# Altium schematic sheet H_bridge_v2.SchDoc
size A4
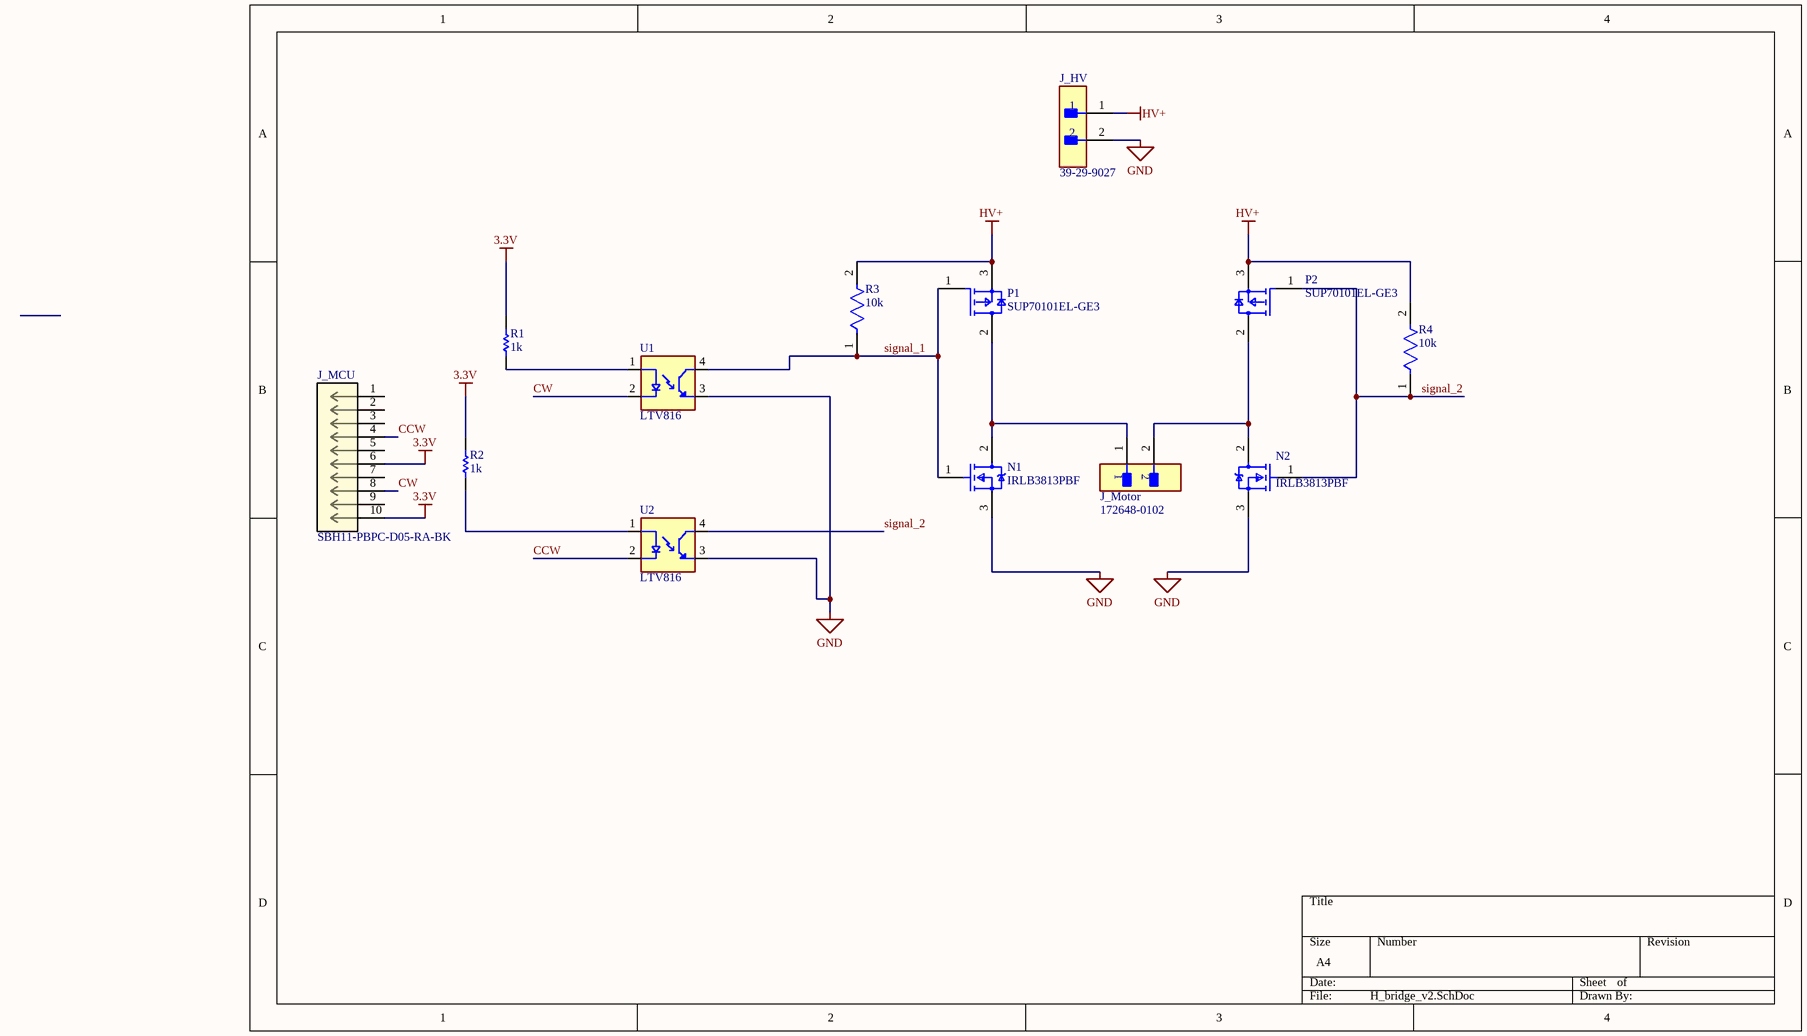
[diagram p0: H_bridge_v2.SchDoc]

## Parts
J_HV  39-29-9027  [FP-39-29-9027-MFG]
J_MCU  SBH11-PBPC-D05-RA-BK  [CONN10_D05-RA-BK_SUL]
J_Motor  172648-0102  [FP-172648-0102-MFG]
N1  IRLB3813PBF  [FP-PG-TO220-3-MFG]
N2  IRLB3813PBF  [FP-PG-TO220-3-MFG]
P1  SUP70101EL-GE3  [FP-SUP70101EL-GE3-MFG]
P2  SUP70101EL-GE3  [FP-SUP70101EL-GE3-MFG]
R1  1k  [RESA60-630X240]
R2  1k  [RESA60-630X240]
R3  10k  [FP-MF0207-MFG]
R4  10k  [FP-MF0207-MFG]
U1  LTV816  [DIP762W50P254L460H450Q4]
U2  LTV816  [DIP762W50P254L460H450Q4]

## Nets
3.3V: J_MCU.6 J_MCU.10 R1.2 R2.2
GND: J_HV.2 N1.3(S) N2.3(S) U1.3(ET) U2.3(ET)
HV+: J_HV.1 P1.3(S) P2.3(S) R3.2 R4.2
CCW: J_MCU.4 U2.2(C)
CW: J_MCU.8 U1.2(C)
signal_1: N1.1(G) P1.1(G) R3.1 U1.4(CT)
signal_2: N2.1(G) P2.1(G) R4.1 U2.4(CT)
NetJ_Motor_1: J_Motor.1 N1.2(D) P1.2(D)
NetJ_Motor_2: J_Motor.2 N2.2(D) P2.2(D)
NetR1_1: R1.1 U1.1(A)
NetR2_1: R2.1 U2.1(A)

Not connected (* = marked no-connect by the designer): J_MCU 1 2 3 5 7 9

## Library data of the parts
J_HV = CMP-04776-000798-1: CONN HEADER VERT 2POS; Insulation Resistance: 1GR; Max Voltage Rating (DC): 600.6kV; Gender: Female; Glow Wire Compliant: Non-compliant; Current Rating: 9A; Contact Resistance: 10mR; Number of Circuits: 2; Row Spacing: 0.165inch; Max Voltage Rating (AC): 600V; Pitch: 4.2mm; Max Current Rating: 5A; Length: 22.15mm; Housing Color: Natural; Orientation: Straight; Contact Material: Brass; Termination: Solder; Height: 9.91mm; Min Operating Temperature: -40°C; Contact Plating: Tin; Flammability Rating: UL94 V-0; Contact Gender: Male; Color: Natural; Contact Type: Male Pin; Depth: 8.77mm; Packaging: Tray; Series: Mini-Fit® Jr™ 5566; Number of Positions: 2; RoHS Compliant: Yes; Number of Contacts: 2; Radiation Hardening: No; Fastening Type: Ramp; Voltage Rating (DC): 600V; Halogen Free: Low Halogen; Mount: Through Hole; Number of Rows: 2; Max Operating Temperature: 105°C; Voltage Rating: 600V; Housing Material: Nylon
J_MCU = SBH11-PBPC-D05-RA-BK: Description; Manufacturer_Name: Sullins; Copyright: Copyright (C) 2026 Ultra Librarian. All rights reserved.; Manufacturer_Part_Number: SBH11-PBPC-D05-RA-BK; RefDes: RefDes; Type: Type
J_Motor = CMP-04776-000216-1: CONN HEADER R/A 2POS 4.2MM
N1 N2 = CMP-32901-000118-1: MOSFET N-CH 30V 260A TO-220AB; Manufacturer: Infineon; Threshold Vgs Max: 2.35V; Gate To Source Voltage: 20V; Number Of N Channels: 1; Threshold Vgs Min: 1.35V; Gate Charge At Vgs: 57nC @ 4.5V; Depletion Mode: False; Max Junction Temp: +175°C; Standoff Height: 3.37mm; Input Capacitace At Vds: 8420pF @ 15V; Reverse Recovery Charge: 22nC; Drain To Source Resistance: 2mΩ; Reverse Recovery Time: 24ns; Pulse Drain Current: 1050A; Turn Off Delay Time: 33ns; Turn On Delay Time: 36ns; Rthja Max: 62°C/W; Max Forward Diode Voltage: 1V; Power Dissipation: 230W; Digikey Description: MOSFET N-CH 30V 260A TO-220AB; Device Class L2: Transistors; Device Class L3: MOSFETs; Device Class L1: Discrete Semiconductors; Footprint Url: https://www.infineon.com/dgdl/po-to220ab-fp.pdf?fileId=5546d462580663ef0158068cfbee01be; ComponentLink2Description: Datasheet; Continuous Drain Current: 260A; Drain To Source Voltage: 30V; Temperature: -55°C to +175°C; Temperature Range Low: -55°C; Octopart: https://octopart.com/irlb3813pbf-infineon-65874923; Number Of Channels: 1; Drain To Source Breakdown Voltage: 30V; Height: 19.8mm; Temperature Range High: +175°C; RoHS: TRUE; Automotive: No; Category: Trans; ComponentLink2URL: https://www.infineon.com/dgdl/irlb3813pbf.pdf?fileId=5546d462533600a4015356603cfe258b; Manufacturer Part Number: IRLB3813PBF; Package: PG-TO220-3; Lead Free: Yes
P1 P2 = CMP-02550-000106-1: MOSFET P-CH 100V 120A TO220AB; Manufacturer: Vishay; Power Dissipation: 375W; Turn On Delay Time: 20ns; Drain To Source Breakdown Voltage: -100V; Gate To Source Voltage: 20V; Max Forward Diode Voltage: -1.5V; Depletion Mode: False; Rthja Max: 40°C/W; Threshold Vgs Max: -2.5V; Drain To Source Resistance: 0.0081Ω; Reverse Recovery Time: 110ns; Transconductance: 60S; Max Junction Temp: +175°C; Number Of Channels: 1; Pulse Drain Current: -240A; Gate Charge At Vgs: 125nC @ -10V; Input Capacitace At Vds: 7000pF @ -50V; Reverse Recovery Charge: 380nC; Continuous Drain Current: -120A; Typ Forward Diode Voltage: -1V; Standoff Height: 3.32mm; Digikey Description: MOSFET P-CH 100V 120A TO220AB; ComponentLink2Description: Datasheet; Category: Trans; Lead Free: Yes; Automotive: No; ComponentLink2URL: http://www.vishay.com/docs/77632/sup70101el.pdf; Device Class L1: Discrete Semiconductors; RoHS: TRUE; Height: 19.31mm; Octopart: https://octopart.com/sup70101el-ge3-vishay-82190902; Threshold Vgs Min: -1.5V; Drain To Source Voltage: -100V; Ipc Land Pattern Name: TO-220; Turn Off Delay Time: 110ns; Device Class L2: Transistors; Temperature: -55°C to +175°C; Package: TO-220AB; Temperature Range High: +175°C; Number Of P Channels: 1; Manufacturer Part Number: SUP70101EL-GE3; Footprint Url: https://www.vishay.com/docs/71195/to220ab.pdf; Device Class L3: MOSFETs; Temperature Range Low: -55°C
R1 R2 = CMP-1659-00075-1: Axial Resistor, 1 KOhm, +/- 1%, 250 mW, -55 to 155 degC, 2-Pin THD, RoHS, Bulk; Voltage Rating: 250 V; Resistance: 10 kohm; Power Rating: 250 mW; ComponentLink2Description: Datasheet; RoHSCompliant: true; PackageReference: MFR-25; Case\Package: Axial; Max Operating Temperature: 155 degC; DatasheetVersion: Apr-13; Tolerance: 1%; ComponentLink1URL: http://www.yageo.com/; Length: 0.248 inch; ComponentLink2URL: http://www.yageo.com/documents/recent/Yageo%20LR_MFR_2013.pdf; Packaging: Bulk; Package Quantity: 200; PackageDescription: 2-Pin Axial Lead, Dia 2.4 mm, Body Length 6.3 mm; Min Operating Temperature: -55 degC; ComponentLink1Description: Manufacturer URL
R3 R4 = CMP-03413-000006-1: RES 10K OHM 1% 0.6W AXIAL; Temperature Coefficient: 50ppm/°C; Resistance: 10kR; Mount: Through Hole; Radiation Hardening: No; Tolerance: 1%; Construction: Cylindrical; Contact Plating: Tin; Case/Package: Conformal; Resistor Type: Metal Film; Min Operating Temperature: -55°C; Military Standard: Not; Lead Free: Lead Free; Diameter: 2.4mm; Termination: Axial; Max Operating Temperature: 155°C; RoHS Compliant: Yes; Packaging: Ammo Pack; Length: 6.3mm
U1 U2 = LTV816: MF: {'manufacturer': u'Lite-On Inc.'}; Package: None; Price: None; Value: *; MP: LTV816; Availability: Unavailable